# Altium schematic sheet Amplifier.SchDoc: FER_TEMPLATE
size A4; Author: Leon Baždar; CompanyName: FER; Address1: Zagreb; SheetNumber: 2; SheetTotal: 7
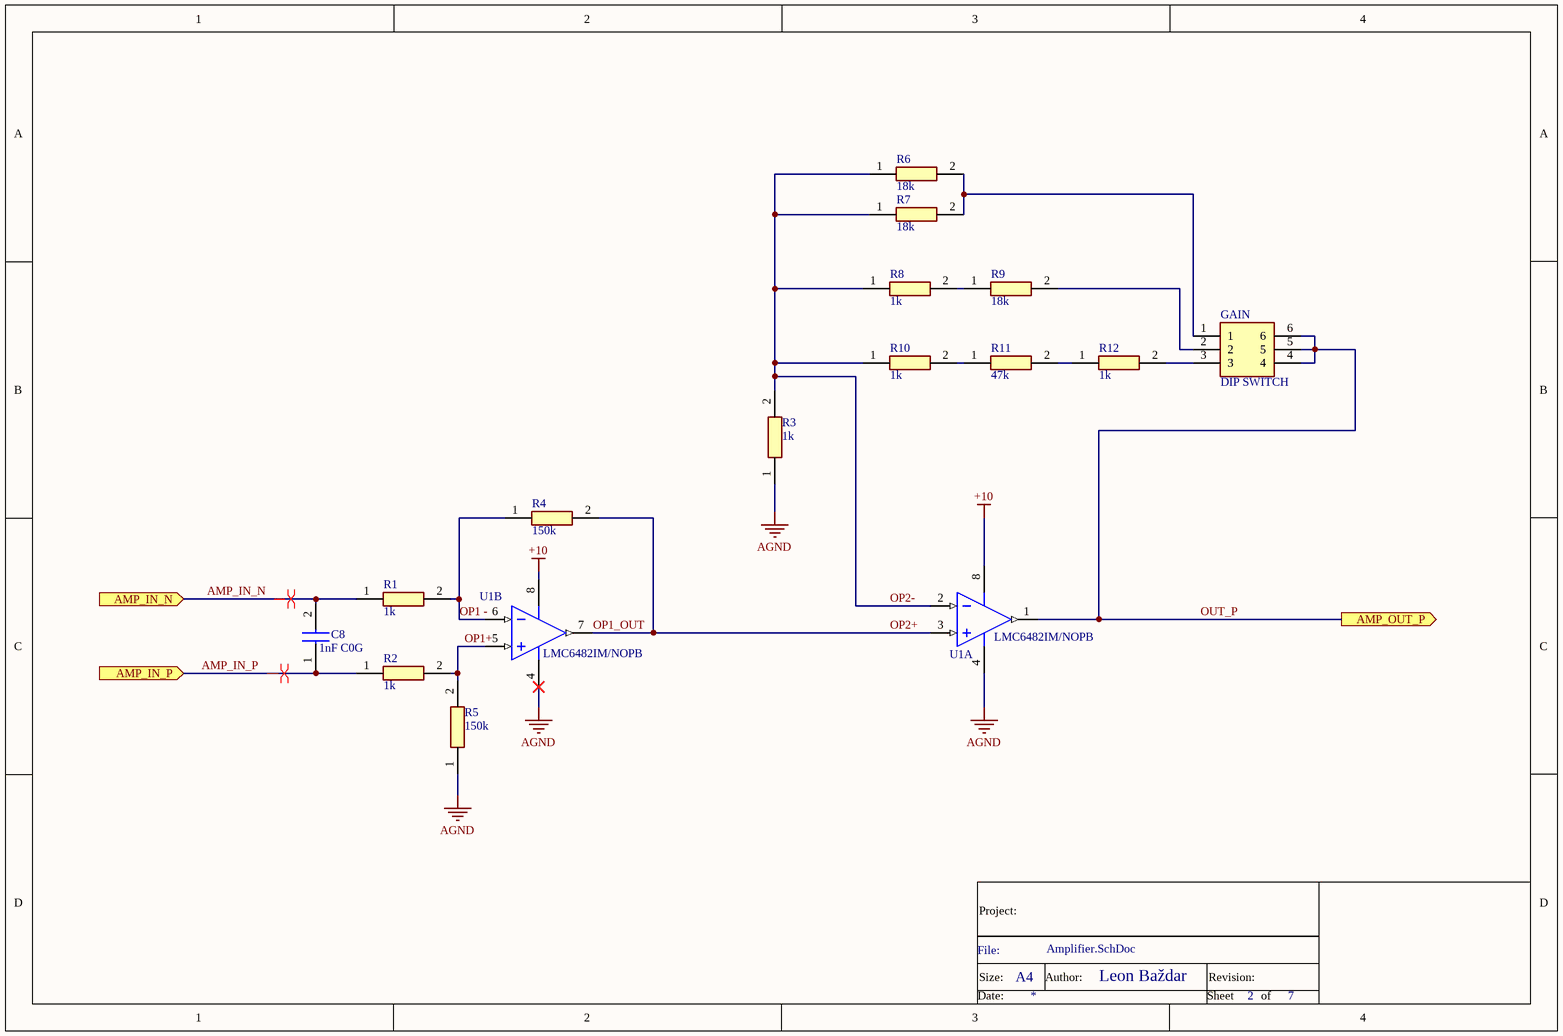
[diagram p0: Amplifier.SchDoc]

## Parts
C8  1nF C0G  [CAPC1005X55N]
GAIN  DIP SWITCH  [2193LPSTR]
R1  1k  [ERA2V_(0402)]
R2  1k  [ERA2V_(0402)]
R3  1k  [ERA2V_(0402)]
R4  150k  [RESC1005X35N]
R5  150k  [RESC1005X35N]
R6  18k  [RESC1005X35N]
R7  18k  [RESC1005X35N]
R8  1k  [ERA2V_(0402)]
R9  18k  [RESC1005X35N]
R10  1k  [ERA2V_(0402)]
R11  47k  [ERA2A_(0402)]
R12  1k  [ERA2V_(0402)]
U1  LMC6482IM/NOPB  [D0008A_N]  (parts A,B of 2)

## Ports
AMP_IN_N (in), AMP_IN_P (in), AMP_OUT_P (out)

## Nets
+10: U1.8(V+)
AGND: R3.1 R5.1 U1.4(V-)
AMP_IN_N: C8.2 R1.1 ; port AMP_IN_N
AMP_IN_P: C8.1 R2.1 ; port AMP_IN_P
OP1 -: R1.2 R4.1 U1.6(INB-)
OP1+: R2.2 R5.2 U1.5(INB+)
OP1_OUT: R4.2 U1.3(INA+) U1.7(OUTB)  [also labelled OP2+]
OP2-: R3.2 R6.1 R7.1 R8.1 R10.1 U1.2(INA-)
OUT_P: GAIN.4 GAIN.5 GAIN.6 U1.1(OUTA) ; port AMP_OUT_P
NetGAIN_1: GAIN.1 R6.2 R7.2
NetGAIN_2: GAIN.2 R9.2
NetGAIN_3: GAIN.3 R12.2
NetR8_2: R8.2 R9.1
NetR10_2: R10.2 R11.1
NetR11_2: R11.2 R12.1

## Layout directives
differential pair: AMP_IN_N, AMP_IN_P

## Notes on the sheet
- Project:
- File:
- Size:
- A4
- Author:
- Revision:
- Date:
- Sheet
- of

## Library data of the parts
C8 = CGA2B2C0G1H102J050BE: Capacitor; Manufacturer_Name: TDK; Datasheet Link: https://product.tdk.com/system/files/dam/doc/product/capacitor/ceramic/mlcc/catalog/mlcc_automotive_soft_en.pdf; Height: 0.55mm; Manufacturer_Part_Number: CGA2B2C0G1H102J050BE
GAIN = 219-3LPSTR: Switch; Manufacturer_Name: CTS; Datasheet Link: https://www.ctscorp.com/wp-content/uploads/219.pdf; Height: 3.95mm; Manufacturer_Part_Number: 219-3LPSTR
R1-R3 R8 R10 R12 = ERA-2VEB1001X: Resistor; Manufacturer_Name: Panasonic; Datasheet Link: http://industrial.panasonic.com/cdbs/www-data/pdf/RDM0000/RDM0000C331.pdf; Height: 0.4mm; Manufacturer_Part_Number: ERA-2VEB1001X
R4 R5 = CPF0402B150KE1: Resistor; Manufacturer_Name: TE Connectivity; Height: 0.35mm; Manufacturer_Part_Number: CPF0402B150KE1
R6 R7 R9 = CPF0402B18KE1: Resistor; Manufacturer_Name: TE Connectivity; Height: 0.35mm; Manufacturer_Part_Number: CPF0402B18KE1
R11 = ERA-2APB473X: Resistor; Manufacturer_Name: Panasonic; Datasheet Link: http://industrial.panasonic.com/cdbs/www-data/pdf/RDM0000/AOA0000C307.pdf; Height: 0.4mm; Manufacturer_Part_Number: ERA-2APB473X
U1 = CMP-0055-00847-3: CMOS Dual Rail-to-Rail Input and Output Operational Amplifier, 8-pin Narrow SOIC, Pb-Free; Manufacturer: Texas Instruments; PackageTopMarking: NSZXTT*LMC64*82IM; CompType: Amplifiers; PowerWise: N; ComponentLink1URL: http://www.ti.com/general/docs/lit/getliterature.tsp?genericPartNumber=LMC6482&fileType=pdf; Code_IPC: SOIC127P600-8; RoHS: Y; PinCount: 8; PackageDescription: SOIC Narrow, 4.9 x 3.9 x 1.45mm, 8 Lead, 1.27mm Pitch; Package Reference: D0008A; ComponentLink1Description: Datasheet URL; Code_JEDEC: MS-012-AA